# EAGLE design Rocky Switch v2 (EAGLE 7.2.0)
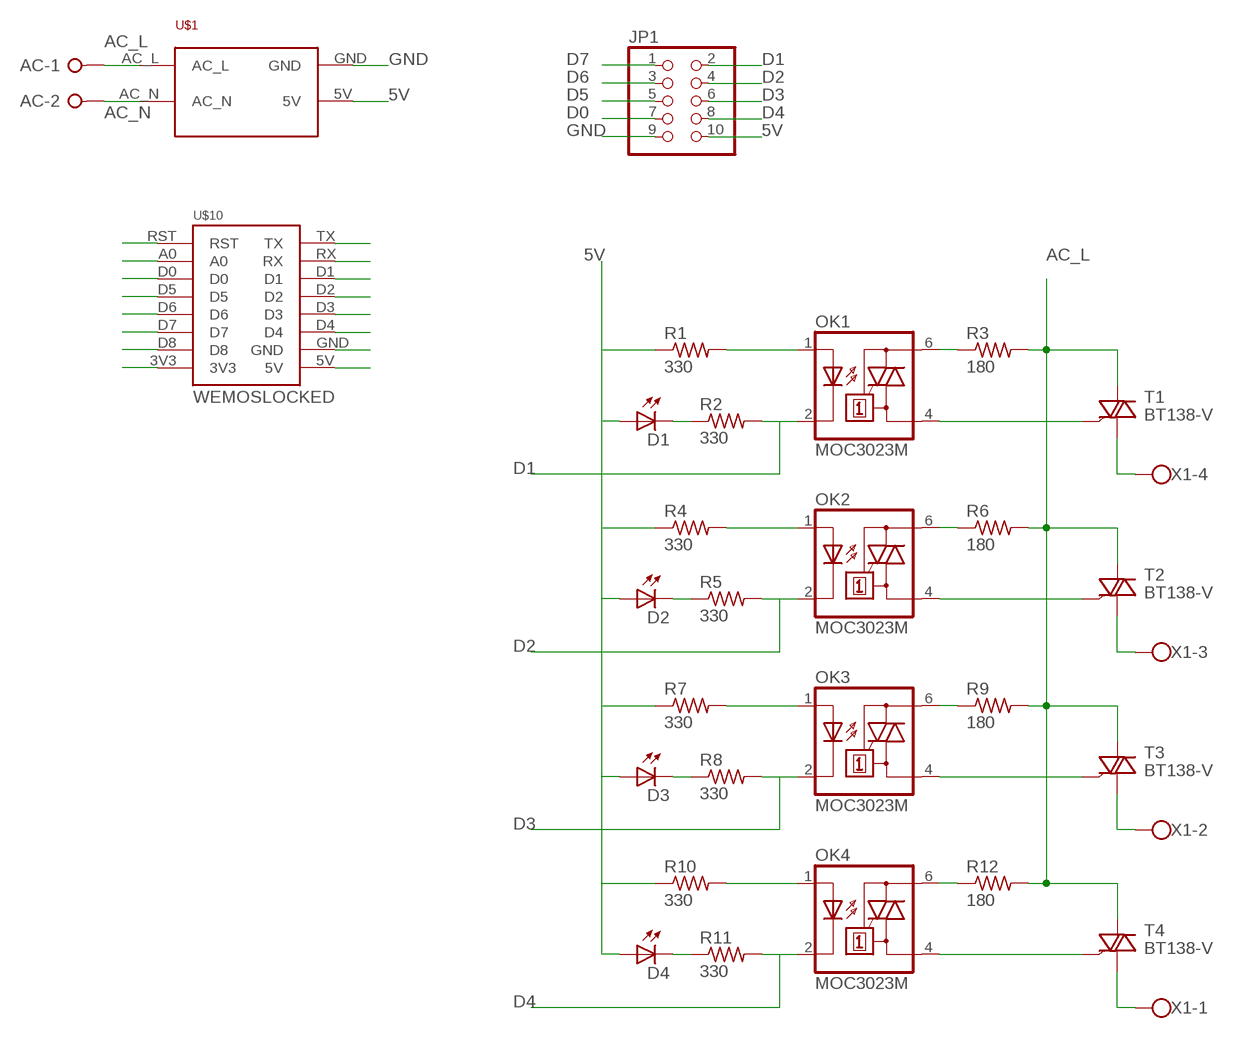
[diagram p0: schematic, sheet 1]

## Parts
AC  W237-02P  [W237-132]
D1  LED3MM  [LED3MM]
D2  LED3MM  [LED3MM]
D3  LED3MM  [LED3MM]
D4  LED3MM  [LED3MM]
JP1  PINHD-2X5  [2X05]
OK1  MOC3023M  [DIL06]
OK2  MOC3023M  [DIL06]
OK3  MOC3023M  [DIL06]
OK4  MOC3023M  [DIL06]
R1  330  R-US_0204/7  [0204/7]
R2  330  R-US_0204/7  [0204/7]
R3  180  R-US_0204/7  [0204/7]
R4  330  R-US_0204/7  [0204/7]
R5  330  R-US_0204/7  [0204/7]
R6  180  R-US_0204/7  [0204/7]
R7  330  R-US_0204/7  [0204/7]
R8  330  R-US_0204/7  [0204/7]
R9  180  R-US_0204/7  [0204/7]
R10  330  R-US_0204/7  [0204/7]
R11  330  R-US_0204/7  [0204/7]
R12  180  R-US_0204/7  [0204/7]
T1  BT138-V  [TO220BV]
T2  BT138-V  [TO220BV]
T3  BT138-V  [TO220BV]
T4  BT138-V  [TO220BV]
U$1  POWER_SUPPLY_220VAC_5V  [POWER_SUPPLY_220VAC_5V]
U$10  WEMOSLOCKED  [WEMOS_LOCKED]
X1  W237-4  [W237-4]

## Nets
3V3: U$10.3V3
5V: D1.A D2.A D3.A D4.A JP1.10 R1.1 R4.1 R7.1 R10.1 U$1.5V U$10.5V
A0: U$10.A0
AC_L: AC.1 R3.2 R6.2 R9.2 R12.2 T1.T2(A2) T2.T2(A2) T3.T2(A2) T4.T2(A2) U$1.AC_L
AC_N: AC.2 U$1.AC_N
D0: JP1.7 U$10.D0
D1: JP1.2 OK1.2(C) R2.2 U$10.D1
D2: JP1.4 OK2.2(C) R5.2 U$10.D2
D3: JP1.6 OK3.2(C) R8.2 U$10.D3
D4: JP1.8 OK4.2(C) R11.2 U$10.D4
D5: JP1.5 U$10.D5
D6: JP1.3 U$10.D6
D7: JP1.1 U$10.D7
D8: U$10.D8
GND: JP1.9 U$1.GND U$10.GND
N$9: OK1.4(A1) T1.G
N$10: OK1.1(A) R1.2
N$14: OK1.6(A2) R3.1
N$15: OK2.4(A1) T2.G
N$16: OK2.1(A) R4.2
N$17: OK2.6(A2) R6.1
N$18: OK3.4(A1) T3.G
N$19: OK3.1(A) R7.2
N$20: OK3.6(A2) R9.1
N$21: T3.T1(A1) X1.2
N$22: T2.T1(A1) X1.3
N$23: T1.T1(A1) X1.4
N$28: D1.K(C) R2.1
N$29: D2.K(C) R5.1
N$30: D3.K(C) R8.1
N$32: OK4.4(A1) T4.G
N$33: OK4.1(A) R10.2
N$34: OK4.6(A2) R12.1
N$35: T4.T1(A1) X1.1
N$38: D4.K(C) R11.1
RST1: U$10.RST
RX: U$10.RX
TX: U$10.TX

## Library data of the parts
AC = con-wago-508:W237-02P: WAGO SREW CLAMP; OC_FARNELL: unknown; OC_NEWARK: unknown
D1-D4 = led:LED: LED OSRAM: - CHIPLED LG R971, LG N971, LY N971, LG Q971, LY Q971, LO R971, LY R971 LH N974, LH R974 LS Q976, LO Q976, LY Q976 LO Q996 - Hyper CHIPLED LW Q18S LB Q993, LB Q99A, LB R99A - SideLED LS A670, LO A670, LY A670, LG A670, LP A670 LB A673, LV A673, LT A673, LW A673 LH A674 LY A675 LS A676, LA A676, LO A676, LY A676, LW A676 LS A679, LY A679, LG A679 - Hyper Micro SIDELED® LS Y876, LA Y876, LO Y876, LY Y876 LT Y87S - SmartLED LW L88C, LW L88S LB L89C, LB L89S, LG L890 LS L89K, LO L89K, LY L89K LS L896, LA L896, LO L896, LY L896 - TOPLED LS T670, LO T670, LY T670, LG T670, LP T670 LSG T670, LSP T670, LSY T670, LOP T670, LYG T670 LG T671, LOG T671, LSG T671 LB T673, LV T673, LT T673, LW T673 LH T674 LS T676, LA T676, LO T676, LY T676, LB T676, LH T676, LSB T676, LW T676 LB T67C, LV T67C, LT T67C, LS T67K, LO T67K, LY T67K, LW E67C LS E67B, LA E67B, LO E67B, LY E67B, LB E67C, LV E67C, LT E67C LW T67C LS T679, LY T679, LG T679 LS T770, LO T770, LY T770, LG T770, LP T770 LB T773, LV T773, LT T773, LW T773 LH T774 LS E675, LA E675, LY E675, LS T675 LS T776, LA T776, LO T776, LY T776, LB T776 LHGB T686 LT T68C, LB T68C - Hyper Mini TOPLED® LB M676 - Mini TOPLED Santana® LG M470 LS M47K, LO M47K, LY M47K Source: http://www.osram.convergy.de LUXEON: - LUMILED® LXK2-PW12-R00, LXK2-PW12-S00, LXK2-PW14-U00, LXK2-PW14-V00 LXK2-PM12-R00, LXK2-PM12-S00, LXK2-PM14-U00 LXK2-PE12-Q00, LXK2-PE12-R00, LXK2-PE12-S00, LXK2-PE14-T00, LXK2-PE14-U00 LXK2-PB12-K00, LXK2-PB12-L00, LXK2-PB12-M00, LXK2-PB14-N00, LXK2-PB14-P00, LXK2-PB14-Q00 LXK2-PR12-L00, LXK2-PR12-M00, LXK2-PR14-Q00, LXK2-PR14-R00 LXK2-PD12-Q00, LXK2-PD12-R00, LXK2-PD12-S00 LXK2-PH12-R00, LXK2-PH12-S00 LXK2-PL12-P00, LXK2-PL12-Q00, LXK2-PL12-R00 Source: www.luxeon.com KINGBRIGHT: KA-3528ASYC Source: www.kingbright.com
JP1 = pinhead:PINHD-2X5: PIN HEADER
OK1-OK4 = optocoupler:MOC30*M: RANDOM-PHASE OPTOISOLATORS TRIAC DRIVER OUTPUT Source: http://www.fairchildsemi.com MOC3020-M.pdf
R1-R12 = rcl:R-US_: RESISTOR, American symbol
T1-T4 = triac:BT138: TRIAC Source: http://www.semiconductors.philips.com BT138_SERIES_2.pdf
U$1 = My Eagle Lib:POWER_SUPPLY_220VAC_5V
U$10 = My Eagle Lib:WEMOS
X1 = con-wago-500:W237-4: WAGO SCREW CLAMP; OC_FARNELL: unknown; OC_NEWARK: unknown

## Board
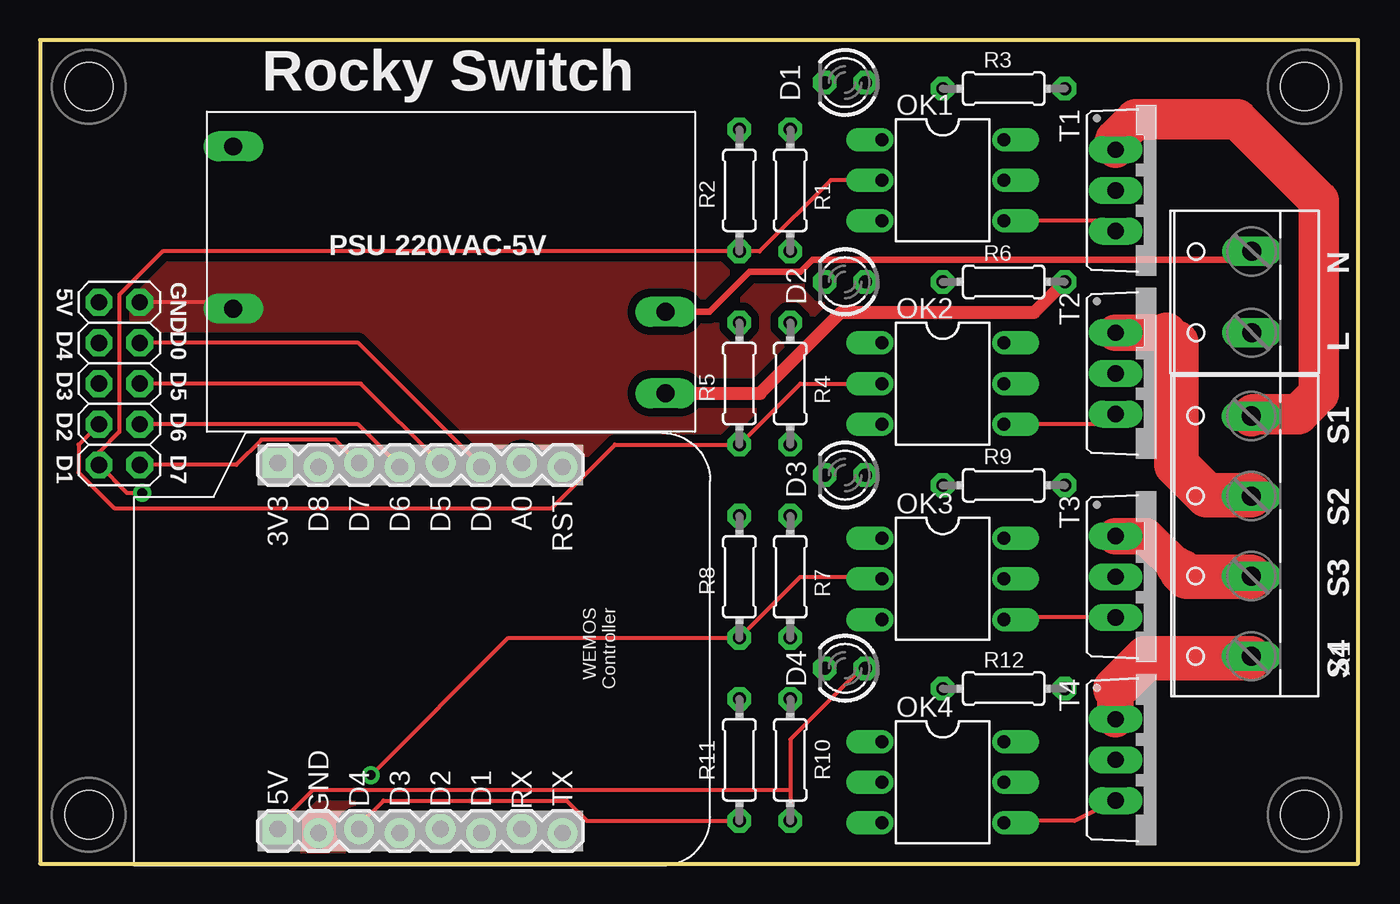
[diagram p1: board, top side]
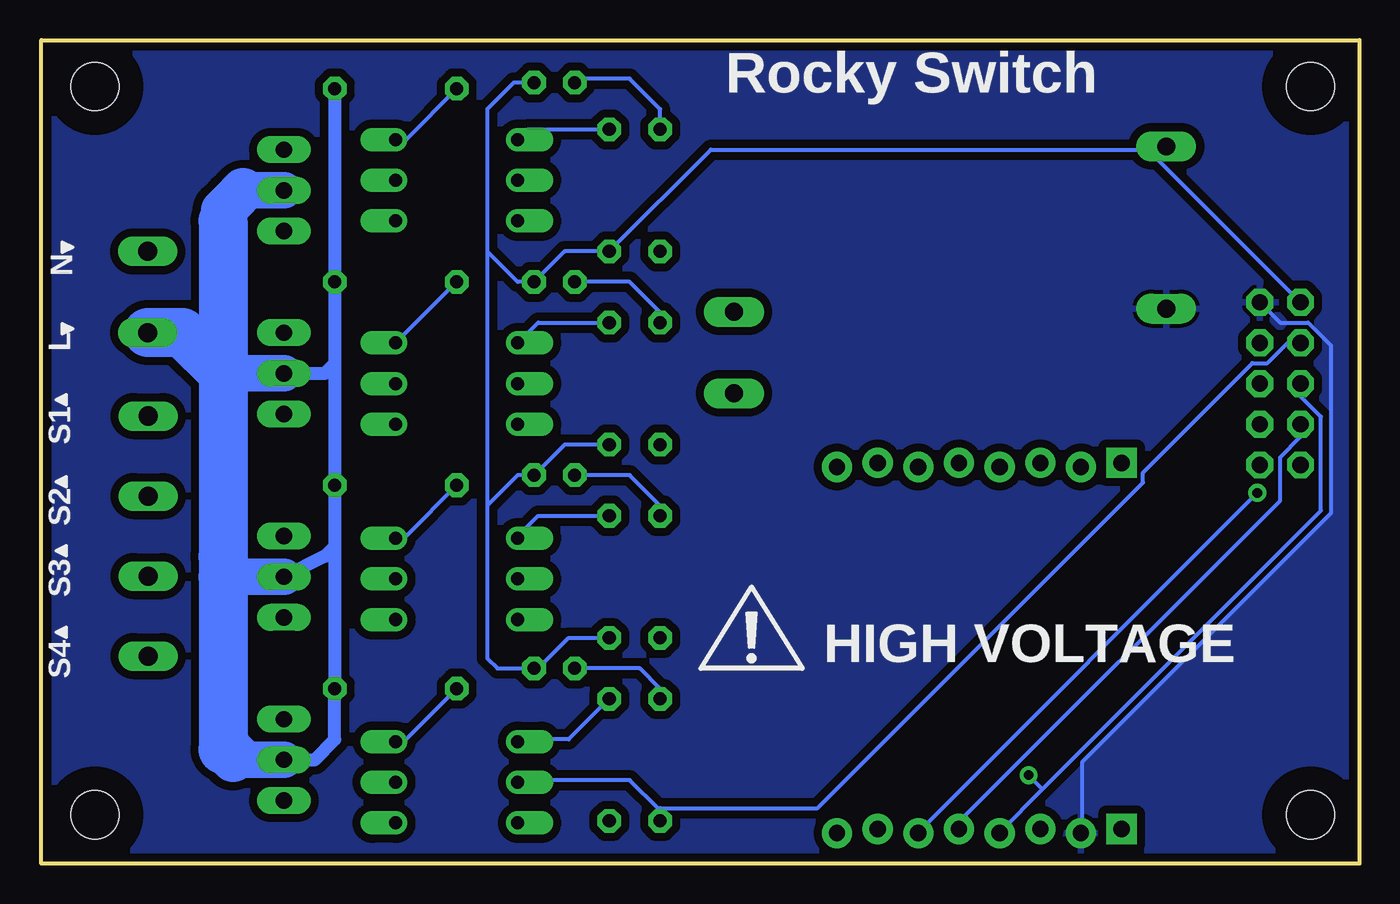
[diagram p2: board, bottom side, seen from below]

Size 82.35 x 51.43 mm. Coordinates in mm from the lower left corner, seen from the top.
Outline: 0,0 82.35,0 82.35,51.43 0,51.43 0,0
Copper layers (1*16): Top 0.035mm / dielectric 1.5mm / Bottom 0.035mm
Design rules "default *": minimum track width 10mil, minimum drill 24mil, track to track 10mil, track to pad 10mil, pad to pad 10mil, via to via 10mil, smd to smd 8mil, copper to edge 20mil, drill to drill 12mil, minimum pad ring 13mil, minimum via ring 10mil, stop-mask expansion 4mil, vias tented up to drill 0mil, thermal gap 10mil

### Footprints (pad centres in the part's own frame; a part is rotated, then mirrored left to right if it is on the bottom)
W237-132 = drill 1.194 long: 1 -2.54,-0.635; 2 2.54,-0.635
LED3MM = drill 0.813 octagon: A -1.27,0; K 1.27,0
2X05 = drill 1.016 octagon: 1 -5.08,-1.27; 2 -5.08,1.27; 3 -2.54,-1.27; 4 -2.54,1.27; 5 0,-1.27; 6 0,1.27; 7 2.54,-1.27; 8 2.54,1.27; 9 5.08,-1.27; 10 5.08,1.27
DIL06 = drill 0.813 offset: 1 -2.54,-3.81; 2 0,-3.81; 3 2.54,-3.81; 4 2.54,3.81; 5 0,3.81; 6 -2.54,3.81
0204/7 = drill 0.813 octagon: 1 -3.81,0; 2 3.81,0
TO220BV = drill 1.016 long: G 2.54,-2.54; T1 -2.54,-2.54; T2 0,-2.54
POWER_SUPPLY_220VAC_5V = drill 1.118 pad 1.88 long: 5V 13.2,-7.82; AC_L -13.8,7.6; AC_N -13.8,2.5; GND 13.2,2.3
KFH-M3 = hole 3: 0,0
WEMOS_LOCKED = drill 1.016 pad 1.88 square: 3V3 -0.127,0; 5V 22.733,0 | drill 1.016 pad 1.88: A0 -0.127,15.24; D0 0.127,12.7; D1 22.987,12.7; D2 22.733,10.16; D3 22.987,7.62; D4 22.733,5.08; D5 -0.127,10.16; D6 0.127,7.62; D7 -0.127,5.08; D8 0.127,2.54; GND 22.987,2.54; RST 0.127,17.78; RX 22.733,15.24; TX 22.987,17.78
W237-4 = drill 1.194 long: 1 -7.5,-1.27; 2 -2.5,-1.27; 3 2.5,-1.27; 4 7.5,-1.27

### Placement (x,y rotation side)
AC  75.06,35.69 90 top
D1  50.29,48.77 180 top
D2  50.29,36.32 180 top
D3  50.29,24.26 180 top
D4  50.29,12.19 180 top
JP1  4.95,29.97 90 top
OK1  56.39,42.67 270 top
OK2  56.39,29.97 270 top
OK3  56.39,17.78 270 top
OK4  56.39,5.08 270 top
R1  46.86,42.04 90 top
R2  43.69,42.04 270 top
R3  60.2,48.39 0 top
R4  46.86,29.97 90 top
R5  43.69,29.97 270 top
R6  60.2,36.32 0 top
R7  46.86,17.91 90 top
R8  43.69,17.91 270 top
R9  60.2,23.62 0 top
R10  46.86,6.48 90 top
R11  43.69,6.48 270 top
R12  60.2,10.92 0 top
T1  69.72,42.04 270 top
T2  69.72,30.61 270 top
T3  69.72,17.91 270 top
T4  69.72,6.48 270 top
U$1  25.27,36.96 180 top
U$2  [ICON_PIN1_B]  81.41,14.45 0 bottom
U$6  [KFH-M3]  3.05,3.05 0 top
U$7  [KFH-M3]  78.99,3.05 0 top
U$8  [KFH-M3]  78.99,48.51 0 top
U$9  [KFH-M3]  3.05,48.51 0 top
U$10  14.86,24.89 270 top
U$11  [ICON_PIN1_B]  80.39,38.48 180 bottom
U$12  [ICON_PIN1_B]  80.39,33.4 180 bottom
U$13  [ICON_PIN1_B]  81.41,28.96 0 bottom
U$14  [ICON_PIN1_B]  81.41,23.85 0 bottom
U$15  [ICON_PIN1_B]  81.41,19.53 0 bottom
U$17  [ICON_EXL-S]  37.97,14.1 0 bottom
X1  74.4,20.45 90 top

### Tracks (layer width: path | path; a pad name or v marks a point on that pad's centre or on a via)
5V
  Top 0.254: 46.86,4.57 46.86,7.75 51.31,12.19 D4.A | 46.86,4.57 R10.1 | 46.86,4.57 17.02,4.57 15.11,2.67 U$10.5V
  Bottom 0.254: R7.1 49.4,14.1 51.31,12.19 D4.A 53.85,12.19 54.48,12.83 54.48,22.35 | 13.21,44.58 40.51,44.58 R1.1 49.66,38.23 D2.A 52.58,36.32 54.48,38.23 | 13.21,44.58 12.57,44.58 U$1.5V 13.21,44.58 | D1.A 52.83,48.77 54.48,47.12 54.48,38.23 | 54.48,38.23 54.48,22.35 | 54.48,22.35 52.58,24.26 D3.A 49.66,26.16 R4.1 | 13.21,44.58 JP1.10
AC_L
  Top 0.813: U$1.AC_L 44.98,29.36 50.04,34.42 62.1,34.42 R6.2
  Bottom 0.254: 70.36,41.4 70.99,40.13
  Bottom 0.813: R3.2 R6.2 64.01,31.24 | 64.01,31.24 R9.2 | R9.2 R12.2 64.01,7.75 65.28,6.48 T4.T2 68.45,6.48 69.72,7.75 | R9.2 64.01,19.81 64.64,19.18 T3.T2 | T2.T2 64.64,30.61 64.01,31.24
  Bottom 2.286: T2.T2 70.99,30.61 | T1.T2 69.72,42.04 | 70.36,6.48 T4.T2 | T3.T2 70.99,17.91 | 70.99,19.18 70.99,7.11
  Bottom 2.794: 69.72,42.04 70.36,41.4 70.99,40.77 | 70.99,7.11 70.36,6.48
  Bottom 3.048: 70.99,30.61 73.53,33.15 AC.1 | 70.99,40.13 70.99,19.18 70.99,17.91 70.99,7.11
AC_N
  Top 0.406: U$1.AC_N 41.82,34.46 44.32,36.96 47.5,36.96 48.26,37.72 75.18,37.72 AC.2
D0
  Top 0.254: JP1.7 19.88,32.51 27.5,24.89 U$10.D0
D1  (via drill 0.61)
  Top 0.254: OK1.2 49.4,42.67 44.96,38.23 R2.2 7.65,38.23 4.95,35.53 4.95,26.96 3.68,25.69 JP1.2 5.43,23.15 v6.38,23.15
  Bottom 0.254: v6.38,23.15 27.5,2.03 U$10.D1
D2
  Top 0.254: OK2.2 47.5,29.97 R5.2 35.91,26.16 31.94,22.19 4.64,22.19 2.41,24.42 2.41,26.16 JP1.4
  Bottom 0.254: JP1.4 3.68,26.64 4.95,25.37 4.95,22.67 24.96,2.67 24.96,2.19 U$10.D2
D3  (via drill 0.61)
  Top 0.254: OK3.2 52.45,17.91 47.5,17.91 R8.2 29.24,14.1 v20.67,5.53
  Bottom 0.254: JP1.6 3.68,29.18 2.41,27.91 2.41,22.04 19.8,4.65 | 19.8,4.65 22.41,2.03 U$10.D3 | 19.8,4.65 v20.67,5.53
D4
  Top 0.254: R11.2 34.16,2.67 32.89,3.94 21.46,3.94 20.19,2.67 U$10.D4
  Bottom 0.254: R11.2 43.69,3.3 43.77,3.38 | 43.77,3.38 45.59,5.21 52.45,5.21 OK4.2 | JP1.8 4.48,32.51 5.75,31.24 6.7,31.24 13.53,24.42 13.53,23.78 33.85,3.46 43.69,3.46 43.77,3.38
D5
  Top 0.254: JP1.5 20.03,29.97 24.96,25.05 U$10.D5
D6
  Top 0.254: JP1.3 19.88,27.43 22.41,24.89 U$10.D6
D7
  Top 0.254: JP1.1 12.26,24.89 13.84,26.48 18.45,26.48 19.88,25.05 U$10.D7
GND
  Top 0.254: JP1.9 11.62,35.05 11.94,34.74 U$1.GND
  Bottom 0.254: JP1.9 4.95,33.78 3.21,33.78 1.78,32.35 1.78,21.88 17.34,6.32 17.34,2.03 U$10.GND
  pour Bottom (isolate 0.508): -10.92,55.37 96.65,55.25 96.65,-4.45 -10.92,-4.32
  pour Top (isolate 0.508, no thermals): -10.92,55.37 96.65,55.25 96.65,-4.45 -10.92,-4.32
N$9
  Top 0.254: OK1.4 66.55,40.13 T1.G
N$10
  Bottom 0.254: R1.2 51.94,45.85 OK1.1
N$14
  Bottom 0.254: OK1.6 59.56,45.21 R3.1
N$15
  Top 0.254: OK2.4 66.55,27.43 T2.G
N$16
  Bottom 0.254: R4.2 51.31,33.78 OK2.1
N$17
  Bottom 0.254: R6.1 OK2.6
N$18
  Top 0.254: T3.G 60.2,15.37 OK3.4
N$19
  Bottom 0.254: R7.2 51.31,21.72 52.58,20.45 OK3.1
N$20
  Bottom 0.254: R9.1 59.56,20.45 60.2,20.45 OK3.6
N$21
  Top 2.286: T3.T1 69.09,20.45 71.31,18.22
  Top 2.54: 70.99,18.54 71.31,18.22 | 75.63,17.91 X1.2
  Top 2.794: 71.31,18.22 71.63,17.91 75.63,17.91
N$22
  Top 2.286: T2.T1 70.36,33.15
  Top 2.54: 70.36,33.15 70.99,32.51 | 75.63,22.99 X1.3
  Top 2.794: 70.99,32.51 70.99,24.89 72.9,22.99 75.63,22.99
N$23
  Top 2.286: T1.T1 67.18,45.21
  Top 2.54: 67.18,45.21 68.45,46.48 74.8,46.48 79.88,41.4 79.88,29.34 78.61,28.07 75.79,28.07 X1.4
N$28
  Bottom 0.254: R2.1 43.69,47.12 45.59,49.02 48.77,49.02 D1.K
N$29
  Bottom 0.254: R5.1 43.69,34.42 45.59,36.32 D2.K
N$30
  Bottom 0.254: R8.1 43.69,22.35 45.59,24.26 D3.K
N$32
  Top 0.254: T4.G 64.64,2.67 60.2,2.67 OK4.4
N$33
  Bottom 0.254: R10.2 49.4,7.75 52.58,7.75 OK4.1
N$34
  Bottom 0.254: R12.1 59.56,7.75 60.2,7.75 OK4.6
N$35
  Top 2.286: T4.T1 67.18,10.92
  Top 2.54: 75.55,12.83 X1.1
  Top 2.794: 67.18,10.92 69.09,12.83 75.55,12.83
N$38
  Bottom 0.254: R11.1 43.69,10.92 44.96,12.19 D4.K

### Text on the board
tNames: Rocky Switch | PSU 220VAC-5V | GND | N | 5V | D4 | D0 | L | D3 | D5 | D2 | D6 | S1 | D1 | D7 | S2 | S3 | S4
bNames: Rocky Switch | N | L | S1 | S2 | S3 | HIGH VOLTAGE | S4